# EAGLE design STELLA_RF (EAGLE 9.6.2)
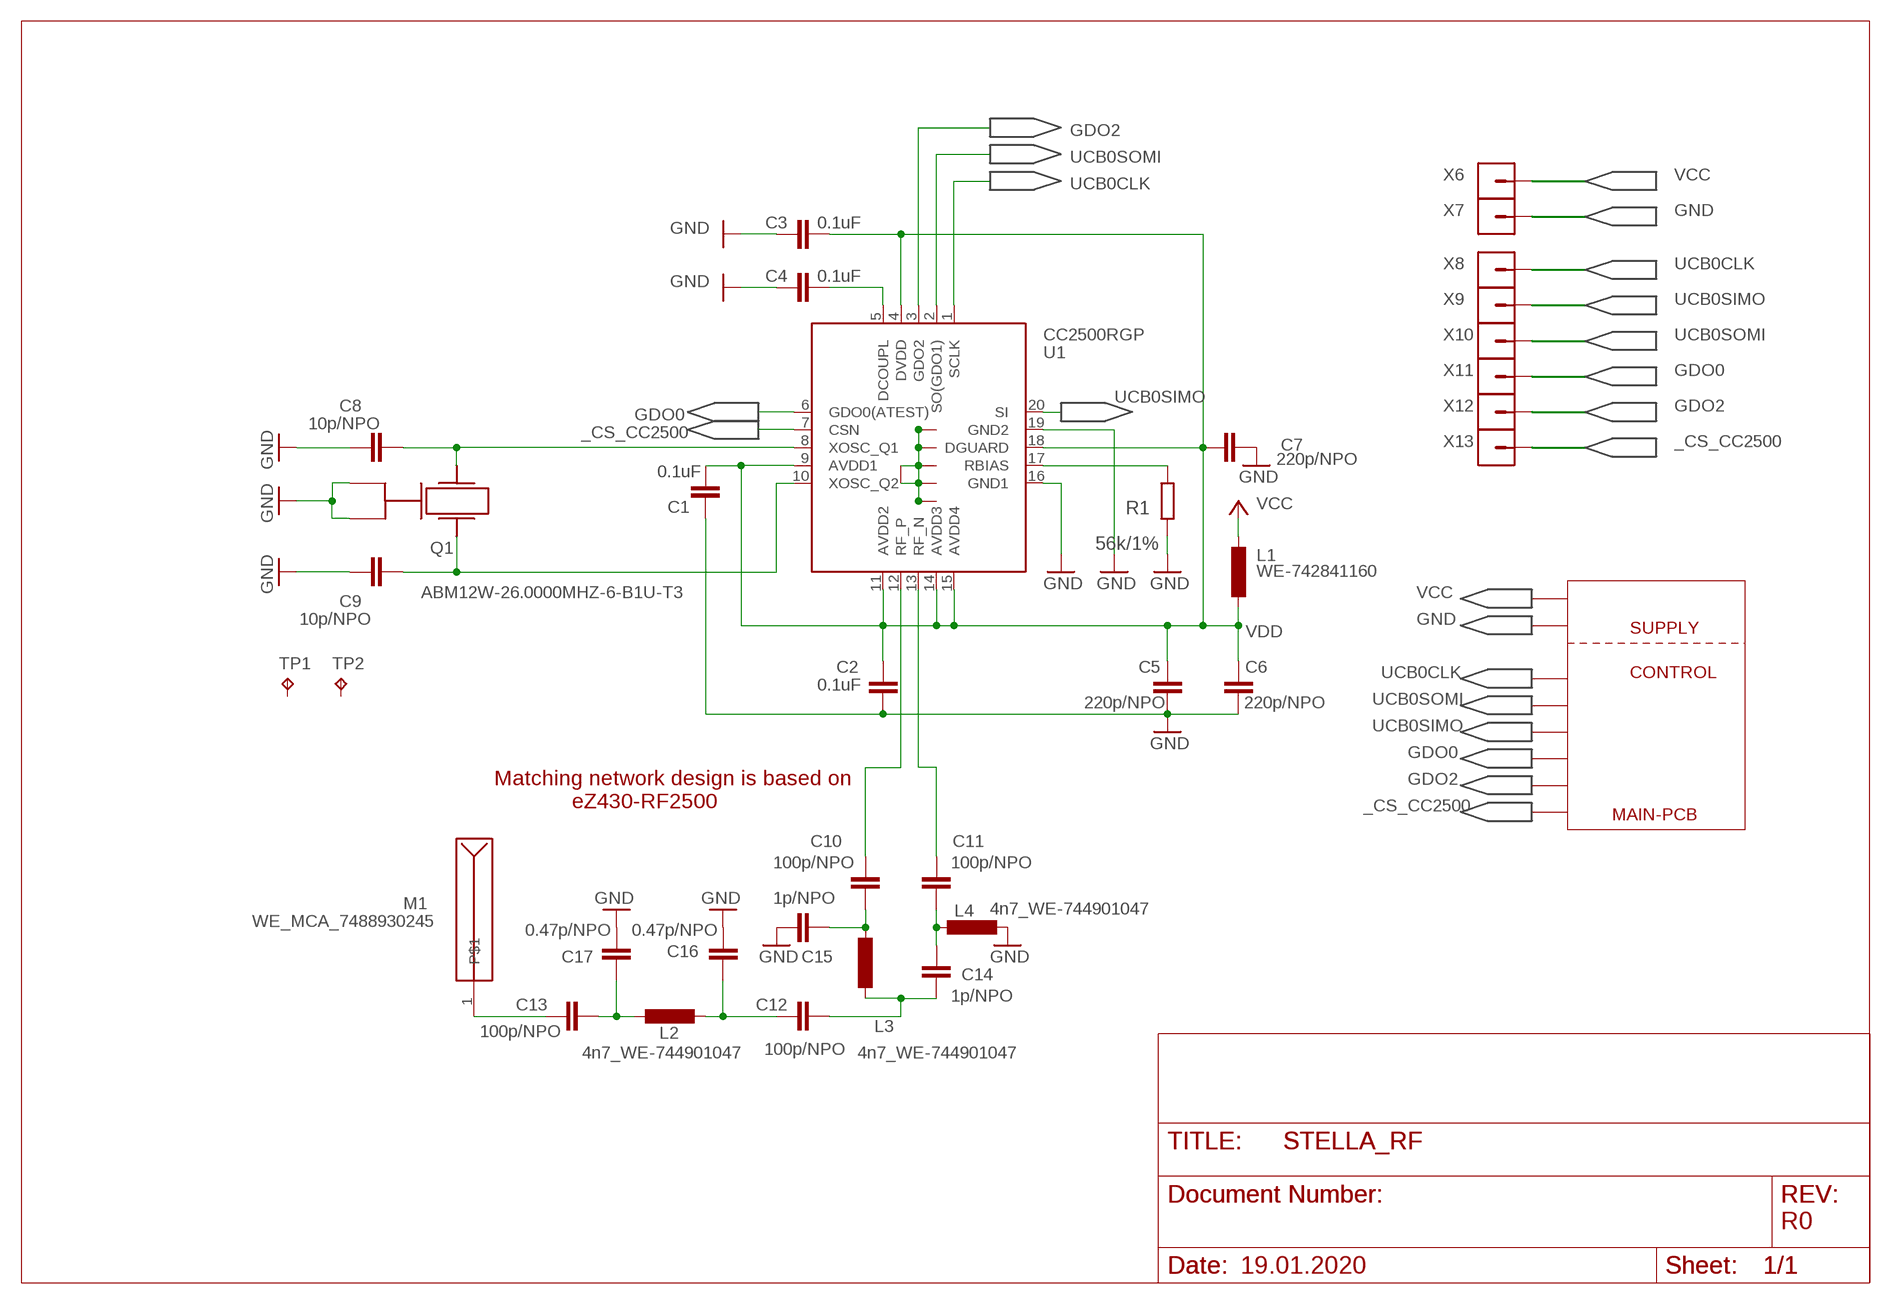
[diagram p0: schematic, sheet 1]

## Parts
C1  0.1uF  C-EUC0402  [C0402]
C2  0.1uF  C-EUC0402  [C0402]
C3  0.1uF  C-EUC0402  [C0402]
C4  0.1uF  C-EUC0402  [C0402]
C5  220p/NPO  C-EUC0402  [C0402]
C6  220p/NPO  C-EUC0402  [C0402]
C7  220p/NPO  C-EUC0402  [C0402]
C8  10p/NPO  C-EUC0402  [C0402]
C9  10p/NPO  C-EUC0402  [C0402]
C10  100p/NPO  C-EUC0402  [C0402]
C11  100p/NPO  C-EUC0402  [C0402]
C12  100p/NPO  C-EUC0402  [C0402]
C13  100p/NPO  C-EUC0402  [C0402]
C14  1p/NPO  C-EUC0402  [C0402]
C15  1p/NPO  C-EUC0402  [C0402]
C16  0.47p/NPO  C-EUC0402  [C0402]
C17  0.47p/NPO  C-EUC0402  [C0402]
L1  WE-742841160  L-EU  [L0402]
L2  4n7_WE-744901047  L-EU  [L0402]
L3  4n7_WE-744901047  L-EU  [L0402]
L4  4n7_WE-744901047  L-EU  [L0402]
M1  WE_MCA_7488930245  [WE_MCA_7488930245]
Q1  ABM12W-26.0000MHZ-6-B1U-T3  ABM12W  [ABM12W]
R1  56k/1%  R-EU_R0402  [R0402]
TP1  TPTP06SQ  [TP06SQ]
TP2  TPTP06SQ  [TP06SQ]
U1  CC2500RGP  CHIPCON_CC1100  [CHIPCON_QLP20]
X6  1PIN_INTERFACE  [1PIN_INTERFACE]
X7  1PIN_INTERFACE  [1PIN_INTERFACE]
X8  1PIN_INTERFACE  [1PIN_INTERFACE]
X9  1PIN_INTERFACE  [1PIN_INTERFACE]
X10  1PIN_INTERFACE  [1PIN_INTERFACE]
X11  1PIN_INTERFACE  [1PIN_INTERFACE]
X12  1PIN_INTERFACE  [1PIN_INTERFACE]
X13  1PIN_INTERFACE  [1PIN_INTERFACE]

## Nets
_CS_CC2500: U1.7(CSN) X13.1
GDO0: U1.6(GDO0(ATEST)) X11.1
GDO2: U1.3(GDO2) X12.1
GND: C1.1 C2.1 C3.1 C4.1 C5.1 C6.1 C7.2 C8.1 C9.1 C15.2 C16.2 C17.2 L4.1 Q1.2 Q1.4 R1.2 U1.16(GND1) U1.19(GND2) U1.EP U1.GND1(G1) U1.GND2(G2) U1.GND3(G3) U1.GND4(G4) U1.GND5(G5) X7.1
N$16: C4.2 U1.5(DCOUPL)
N$17: C13.1 M1.1
N$18: C8.2 Q1.1 U1.8(XOSC_Q1)
N$19: R1.1 U1.17(RBIAS)
N$20: C9.2 Q1.3 U1.10(XOSC_Q2)
N$22: C13.2 C17.1 L2.1
N$23: C12.2 C16.1 L2.2
N$24: C10.2 C15.1 L3.2
N$25: C12.1 C14.2 L3.1
N$26: C11.2 C14.1 L4.2
N$27: C10.1 U1.12(RF_P)
N$28: C11.1 U1.13(RF_N)
UCB0CLK: U1.1(SCLK) X8.1
UCB0SIMO: U1.20(SI) X9.1
UCB0SOMI: U1.2(SO(GDO1)) X10.1
VCC: L1.1 X6.1
VDD: C1.2 C2.2 C3.2 C5.2 C6.2 C7.1 L1.2 U1.4(DVDD) U1.9(AVDD1) U1.11(AVDD2) U1.14(AVDD3) U1.15(AVDD4) U1.18(DGUARD)
Unconnected: TP1.TP TP2.TP

## Notes on the sheet
- X6
- X7
- X8
- X9
- X10
- X11
- X12
- X13
- VCC
- GND
- SUPPLY
- CONTROL
- MAIN-PCB
- Matching network design is based on 
               eZ430-RF2500
- M1
- WE_MCA_7488930245
- R0
- 19.01.2020

## Library data of the parts
C1-C17 = UKN_rcl:C-EU: CAPACITOR, European symbol
L1-L4 = UKN_rcl:L-EU: INDUCTOR, European symbol
M1 = antennas:WE_MCA_7488930245
Q1 = ABM12W:ABM12W
R1 = UKN_rcl:R-EU_: RESISTOR, European symbol
TP1 TP2 = testpad:TP: Test pad
U1 = eZ430-RF2500T_HW-V1.0_20070403:CHIPCON_CC1100
X6-X13 = stella2.1_bilateral_MainPCB:1PIN_INTERFACE

## Net classes
0 default: width 0.25 mm
1 GND: width 0.4 mm
2 VCC: width 0.4 mm

## Board
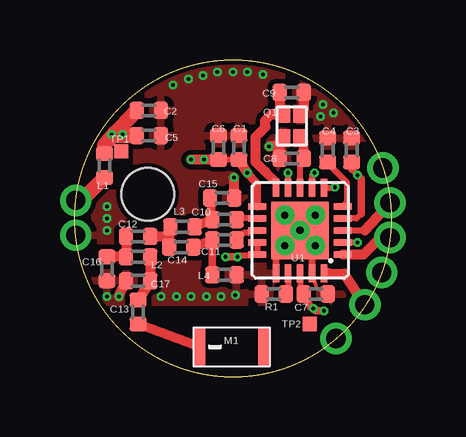
[diagram p1: board, top side]
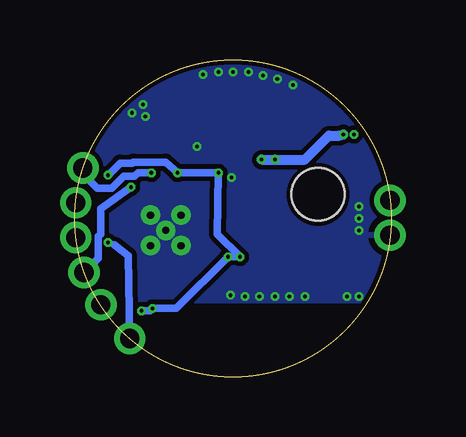
[diagram p2: board, bottom side, seen from below]

Size 13.2 x 13.2 mm. Coordinates in mm from the lower left corner, seen from the top.
Outline: circle at 6.6,6.6 radius 6.6
Copper layers (1*16): Top 0.035mm / dielectric 0.9mm / Bottom 0.035mm
Design rules "default *": minimum track width 5mil, minimum drill 3mil, track to track 2mil, track to pad 2mil, pad to pad 2mil, via to via 2mil, smd to smd 2mil, copper to edge 2mil, drill to drill 3mil, minimum pad ring 10mil, minimum via ring 4mil, stop-mask expansion 4mil, vias tented up to drill 0mil, thermal gap 10mil
Holes 2.2 mm at 3.05,7.6

### Footprints (pad centres in the part's own frame; a part is rotated, then mirrored left to right if it is on the bottom)
C0402 = smd 0.6 x 0.7: 1 -0.5,0; 2 0.5,0
L0402 = smd 0.6 x 0.7: 1 -0.5,0; 2 0.5,0
WE_MCA_7488930245 = smd 1.6 x 0.5: 1 0,1.35; 2 0,-1.35
ABM12W = smd 0.73 x 0.58: 1 0.5,0.35; 2 -0.5,0.35; 3 -0.5,-0.35; 4 0.5,-0.35
R0402 = smd 0.6 x 0.7: 1 -0.5,0; 2 0.5,0
TP06SQ = smd 0.6 x 0.6: TP 0,0
CHIPCON_QLP20 = smd 0.76 x 0.28: 1 -1.78,1; 2 -1.78,0.5; 3 -1.78,0; 4 -1.78,-0.5; 5 -1.78,-1; 11 1.78,-1; 12 1.78,-0.5; 13 1.78,0; 14 1.78,0.5; 15 1.78,1 | smd 0.28 x 0.76: 6 -1,-1.78; 7 -0.5,-1.78; 8 0,-1.78; 9 0.5,-1.78; 10 1,-1.78; 16 1,1.78; 17 0.5,1.78; 18 0,1.78; 19 -0.5,1.78; 20 -1,1.78 | smd 2.4 x 2.4: EP 0,0 | drill 0.3: GND1 0,0; GND2 -0.635,0.635; GND3 0.635,0.635; GND4 -0.635,-0.635; GND5 0.635,-0.635
1PIN_INTERFACE = drill 0.8 pad 1.1: 1 0,0

### Placement (x,y rotation side)
C1  6.85,9.55 270 top
C2  3.1,11.1 180 top
C3  11.55,9.45 270 top
C4  10.55,9.45 270 top
C5  3.1,10.05 180 top
C6  6,9.55 270 top
C7  10.05,3.45 0 top
C8  9.05,9.1 0 top
C9  9.05,11.85 180 top
C10  6.25,6.55 180 top
C11  6.25,5.7 180 top
C12  2.65,5.85 180 top
C13  2.65,2.7 90 top
C14  4.45,5.4 180 top
C15  6.15,7.45 0 top
C16  1.35,4.5 270 top
C17  2.65,4 180 top
L1  1.25,8.8 90 top
L2  2.65,5 180 top
L3  4.5,6.25 0 top
L4  6.25,4.25 180 top
M1  6.55,1.25 90 top
Q1  9.05,10.45 270 top
R1  8.3,3.45 180 top
TP1  1.95,9.4 0 top
TP2  9.8,2.2 180 top
U1  9.4,6.1 180 top
X6  0.05,7.35 0 top
X7  0.05,5.9 0 top
X8  13.15,5.8 0 top
X9  12.1,3 0 top
X10  10.9,1.6 0 top
X11  12.8,4.35 0 top
X12  13.15,7.25 0 top
X13  12.85,8.7 0 top

### Tracks (layer width: path | path; a pad name or v marks a point on that pad's centre or on a via)
_CS_CC2500  (via drill 0.15 pad 0.3)
  Top 0.254: U1.7 9.9,8.4 v10,8.5
  Bottom 0.305: v10,8.5 10.55,8.5 10.7,8.35 11.15,8.35 11.65,7.85 12.25,7.85 12.65,8.25 12.65,8.5 X13.1
GDO0  (via drill 0.15 pad 0.3)
  Top 0.254: U1.6 10.77,7.88 v10.85,7.9
  Bottom 0.305: X11.1 12.2,4.95 12.2,5.85 12.1,5.95 12.1,7 v10.85,7.9
GDO2
  Top 0.254: U1.3 12.1,6.1
  Top 0.406: 12.1,6.1 X12.1
GND  (via drill 0.15 pad 0.3)
  Top 0.15: 8.4,4.95 arc-71 U1.GND3 arc51 U1.EP | 9.9,4.9 arc-27 U1.GND2 arc144 U1.EP | U1.GND5 U1.EP | U1.GND4 U1.EP | C7.2 10.1,3.7 U1.19
  Top 0.254: 8.55,9.8 Q1.4 | 9.55,11.1 Q1.2 | U1.16 8.4,4.95 | U1.19 9.9,4.9
  Top 0.406: C8.1 8.55,9.6 | C9.1 9.55,11.1 | v1.85,3.35 C17.2 | C15.2 v6.65,8.3 | 8.55,9.8 8.55,9.6 | 8.55,9.6 v8.1,9.6
  other vias: 10.8,11 10.35,11.35 7.85,12.6 7.2,12.7 6.6,12.7 5.95,12.7 5.35,12.55 4.75,12.4 4.1,12.15 3.6,3.35 4.25,3.35 4.85,3.35 5.5,3.35 6.1,3.35 6.7,3.4 1.35,7.1 1.35,6.6 1.35,6.1 1.35,3.35 10.25,10.85
  pour Top (isolate 0.2): 0.05,5.9 0.05,7.2 0.25,8.3 0.65,9.35 1.25,10.4 1.95,11.2 2.7,11.9 3.55,12.4 4.8,12.95 6.55,13.25 7.6,13.1 8.8,12.8 9.7,12.4 10.9,11.6 11.75,10.7 12.25,9.9 12.75,8.85 13.05,7.9 13.15,6.4 13.05,5.45 12.75,4.3 12.25,3.25 12.15,3.1 1.05,3.1 0.5,4.2
  pour Bottom (isolate 0.2): 1.1,3.1 0.5,4.35 0.2,5.4 0.1,6.25 0.15,7.65 0.55,9.15 1.4,10.65 3,12.1 4.85,12.95 6.5,13.2 7.85,13.05 9.35,12.55 10.65,11.8 11.7,10.75 12.6,9.25 13.1,7.85 13.15,6.3 12.95,4.95 12.4,3.6 12.15,3.1
N$16
  Top 0.254: C4.2 10.55,8.9 11.35,8.1 11.35,7.27 U1.5
N$17
  Top 0.406: M1.1 C13.1
N$18
  Top 0.254: U1.8 9.4,8.95 C8.2 | 9.55,9.8 Q1.1
  Top 0.406: C8.2 9.55,9.8
N$19
  Top 0.254: U1.17 8.9,3.55 R1.1
N$20
  Top 0.254: U1.10 8.4,8.1 | 8.55,11.1 Q1.3
  Top 0.353: 8.4,8.1 7.95,8.55
  Top 0.406: 7.95,8.55 7.55,8.95 7.55,10 7.95,10.4 7.95,10.7 8.2,10.95 Q1.3 | C9.2 8.55,11.1
N$22
  Top 0.406: L2.1 C17.1 C13.2
N$23
  Top 0.406: C12.2 L2.2 C16.1
N$24
  Top 0.353: C10.2 C15.1
  Top 0.406: C10.2 L3.2
N$25
  Top 0.254: L3.1 C14.2 3.95,5.85
  Top 0.406: C12.1 3.95,5.85
N$26
  Top 0.305: C11.2 L4.2
  Top 0.406: C11.2 C14.1
N$27
  Top 0.254: U1.12 6.8,6.6 C10.1
N$28
  Top 0.254: U1.13 7.35,6.1 7.25,6 7.05,6 C11.1
UCB0CLK
  Top 0.406: U1.1 12.05,5.1 12.75,5.8 X8.1
UCB0SIMO
  Top 0.254: U1.20 10.58,4.32
  Top 0.406: 10.58,4.32 11.25,4.3 X9.1
UCB0SOMI  (via drill 0.15 pad 0.3)
  Top 0.254: U1.2 v11.8,5.6
  Bottom 0.254: v11.8,5.6 11.55,5.5
  Bottom 0.305: 11.55,5.5 10.95,5.05 X10.1
VCC
  Top 0.61: X6.1 0.3,7.35 L1.1
VDD  (via drill 0.15 pad 0.3)
  Top 0.254: U1.18 9.4,3.6 C7.1 | 11.95,8.25 v11.8,8.4 11.55,8.65 | 11.95,6.8 11.75,6.6 U1.4 | U1.9 v8.9,8.5 | C1.2 C6.2 | v2,10.1 v1.55,10.1 1.6,10.05 | U1.14 U1.15 7.35,5.1 7.3,5.05 6.85,5.05 v6.8,5
  Top 0.305: C3.2 11.55,8.65 | 11.95,8.25 11.95,6.8 | v6.8,5 v6.3,5 | v10.4,2.75 10.05,2.75 v9.95,2.85 9.9,2.85 9.85,2.9 C7.1
  Top 0.353: v7.2,8.5 7.6,8.05 7.6,7.12 U1.11
  Top 0.406: C1.2 v7.2,8.5 | C6.2 v4.85,9.05
  Top 0.61: L1.2 1.25,9.65 1.7,10.2 1.7,10.05 C5.2 1.6,10.05 C2.2
  Bottom 0.254: 10.8,8.9 10.75,8.95
  Bottom 0.305: 10.8,8.9 11.3,8.9 v11.8,8.4 | 10.75,8.95 9.4,8.95 v8.9,8.5 v7.2,8.5 7.25,5.95 v6.3,5 v6.8,5 8.95,2.85 v9.95,2.85 10.05,2.75 v10.4,2.75
  Bottom 0.406: v2,10.1 2.15,10.05 C5.2 3.6,9.05 v4.85,9.05 v5.4,9.05

### Text on the board
Document: LED HOLE | 1.5mm | diam.
Reference: Steg | Steg